# Altium project OSD19001_BRK_X2.PrjPCB
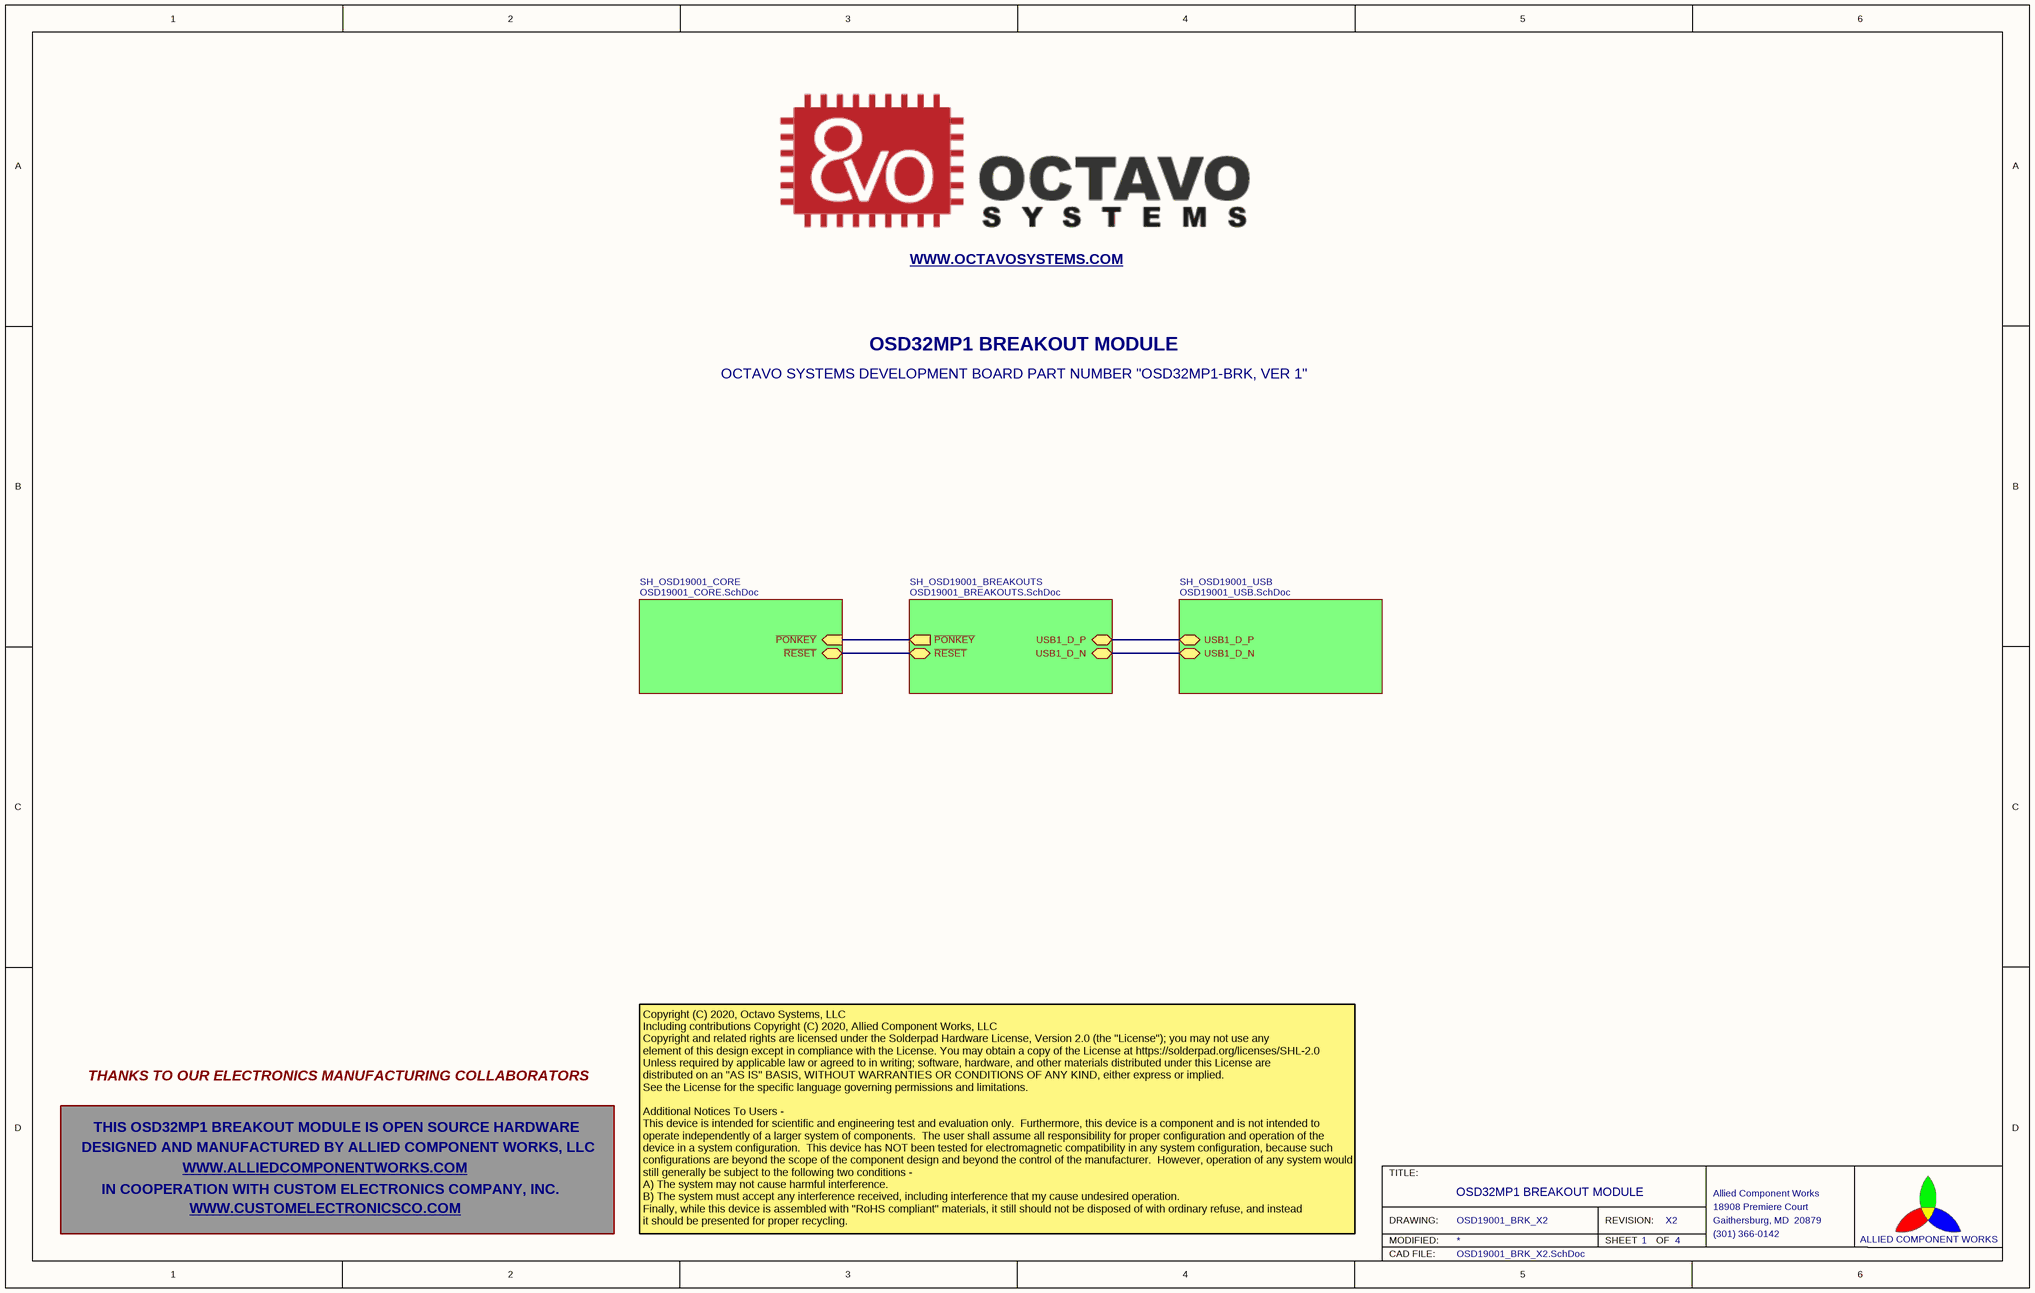
[diagram p0: OSD19001_BRK_X2.SchDoc]
ProjectAddress1: 18908 Premiere Court; ProjectAddress2: Gaithersburg, MD  20879; ProjectCompanyDrawingNumber: OSD19001_BRK_X2; ProjectCompanyName: Allied Component Works; ProjectCompanyPhone: (301) 366-0142; ProjectDrawingNUmber: OSD19001_BRK_X2; ProjectRevision: X2
4 sheets, 162 parts. Net scope: hierarchical (ports join the sheet entries above them; power ports are global).
Board file: OSD19001_BRK_X2.PcbDoc
Sheets:
  OSD19001_BRK_X2.SchDoc
    SH_OSD19001_CORE = OSD19001_CORE.SchDoc
    SH_OSD19001_BREAKOUTS = OSD19001_BREAKOUTS.SchDoc
    SH_OSD19001_USB = OSD19001_USB.SchDoc

## Sheet OSD19001_BRK_X2.SchDoc
size B; Organization: Altium Limited; DocumentNumber: 1; SheetNumber: 1; SheetTotal: 4; SchematicTitle: OSD32MP1 BREAKOUT MODULE

### Sub-sheets
SH_OSD19001_BREAKOUTS = OSD19001_BREAKOUTS.SchDoc: ~{PONKEY} (out), ~{RESET} (bidir), USB1_D_P (bidir), USB1_D_N (bidir)
SH_OSD19001_CORE = OSD19001_CORE.SchDoc: ~{PONKEY} (in), ~{RESET} (bidir)
SH_OSD19001_USB = OSD19001_USB.SchDoc: USB1_D_P (bidir), USB1_D_N (bidir)

### Nets
~{PONKEY}: sheet SH_OSD19001_CORE/~{PONKEY}, sheet SH_OSD19001_BREAKOUTS/~{PONKEY}
~{RESET}: sheet SH_OSD19001_CORE/~{RESET}, sheet SH_OSD19001_BREAKOUTS/~{RESET}
USB1_D_N: sheet SH_OSD19001_BREAKOUTS/USB1_D_N, sheet SH_OSD19001_USB/USB1_D_N
USB1_D_P: sheet SH_OSD19001_BREAKOUTS/USB1_D_P, sheet SH_OSD19001_USB/USB1_D_P

### Notes on the sheet
- WWW.OCTAVOSYSTEMS.COM <http://WWW.OCTAVOSYSTEMS.COM>
- OSD32MP1 BREAKOUT MODULE
- OCTAVO SYSTEMS DEVELOPMENT BOARD PART NUMBER "OSD32MP1-BRK, VER 1"
- THANKS TO OUR ELECTRONICS MANUFACTURING COLLABORATORS
- DESIGNED AND MANUFACTURED BY ALLIED COMPONENT WORKS, LLC
- THIS OSD32MP1 BREAKOUT MODULE IS OPEN SOURCE HARDWARE
- WWW.ALLIEDCOMPONENTWORKS.COM <http://WWW.ALLIEDCOMPONENTWORKS.COM>
- IN COOPERATION WITH CUSTOM ELECTRONICS COMPANY, INC.
- WWW.CUSTOMELECTRONICSCO.COM <http://WWW.CUSTOMELECTRONICSCO.COM>
- Copyright (C) 2020, Octavo Systems, LLC
  Including contributions Copyright (C) 2020, Allied Component Works, LLC
  Copyright and related rights are licensed under the Solderpad Hardware License, Version 2.0 (the "License"); you may not use any
  element of this design except in compliance with the License. You may obtain a copy of the License at https://solderpad.org/licenses/SHL-2.0
  Unless required by applicable law or agreed to in writing; software, hardware, and other materials distributed under this License are
  distributed on an "AS IS" BASIS, WITHOUT WARRANTIES OR CONDITIONS OF ANY KIND, either express or implied.
  See the License for the specific language governing permissions and limitations.
  Additional Notices To Users -
  This device is intended for scientific and engineering test and evaluation only.  Furthermore, this device is a component and is not intended to operate independently of a larger system of components.  The user shall assume all responsibility for proper configuration and operation of the device in a system configuration.  This device has NOT been tested for electromagnetic compatibility in any system configuration, because such configurations are beyond the scope of the component design and beyond the control of the manufacturer.  However, operation of any system would still generally be subject to the following two conditions -
  A) The system may not cause harmful interference.
  B) The system must accept any interference received, including interference that my cause undesired operation.
  Finally, while this device is assembled with "RoHS compliant" materials, it still should not be disposed of with ordinary refuse, and instead
  it should be presented for proper recycling.
- TITLE:
- DRAWING:
- MODIFIED:
- REVISION:
- SHEET
- OF
- ALLIED COMPONENT WORKS
- CAD FILE:

## Sheet OSD19001_CORE.SchDoc: <title>
size B; Organization: Altium Limited; DocumentNumber: 2; SheetNumber: 2; SheetTotal: 4; DrawingNumber: <drawing number>; SchematicTitle: OSD32MP1 BREAKOUT MODULE (CORE)
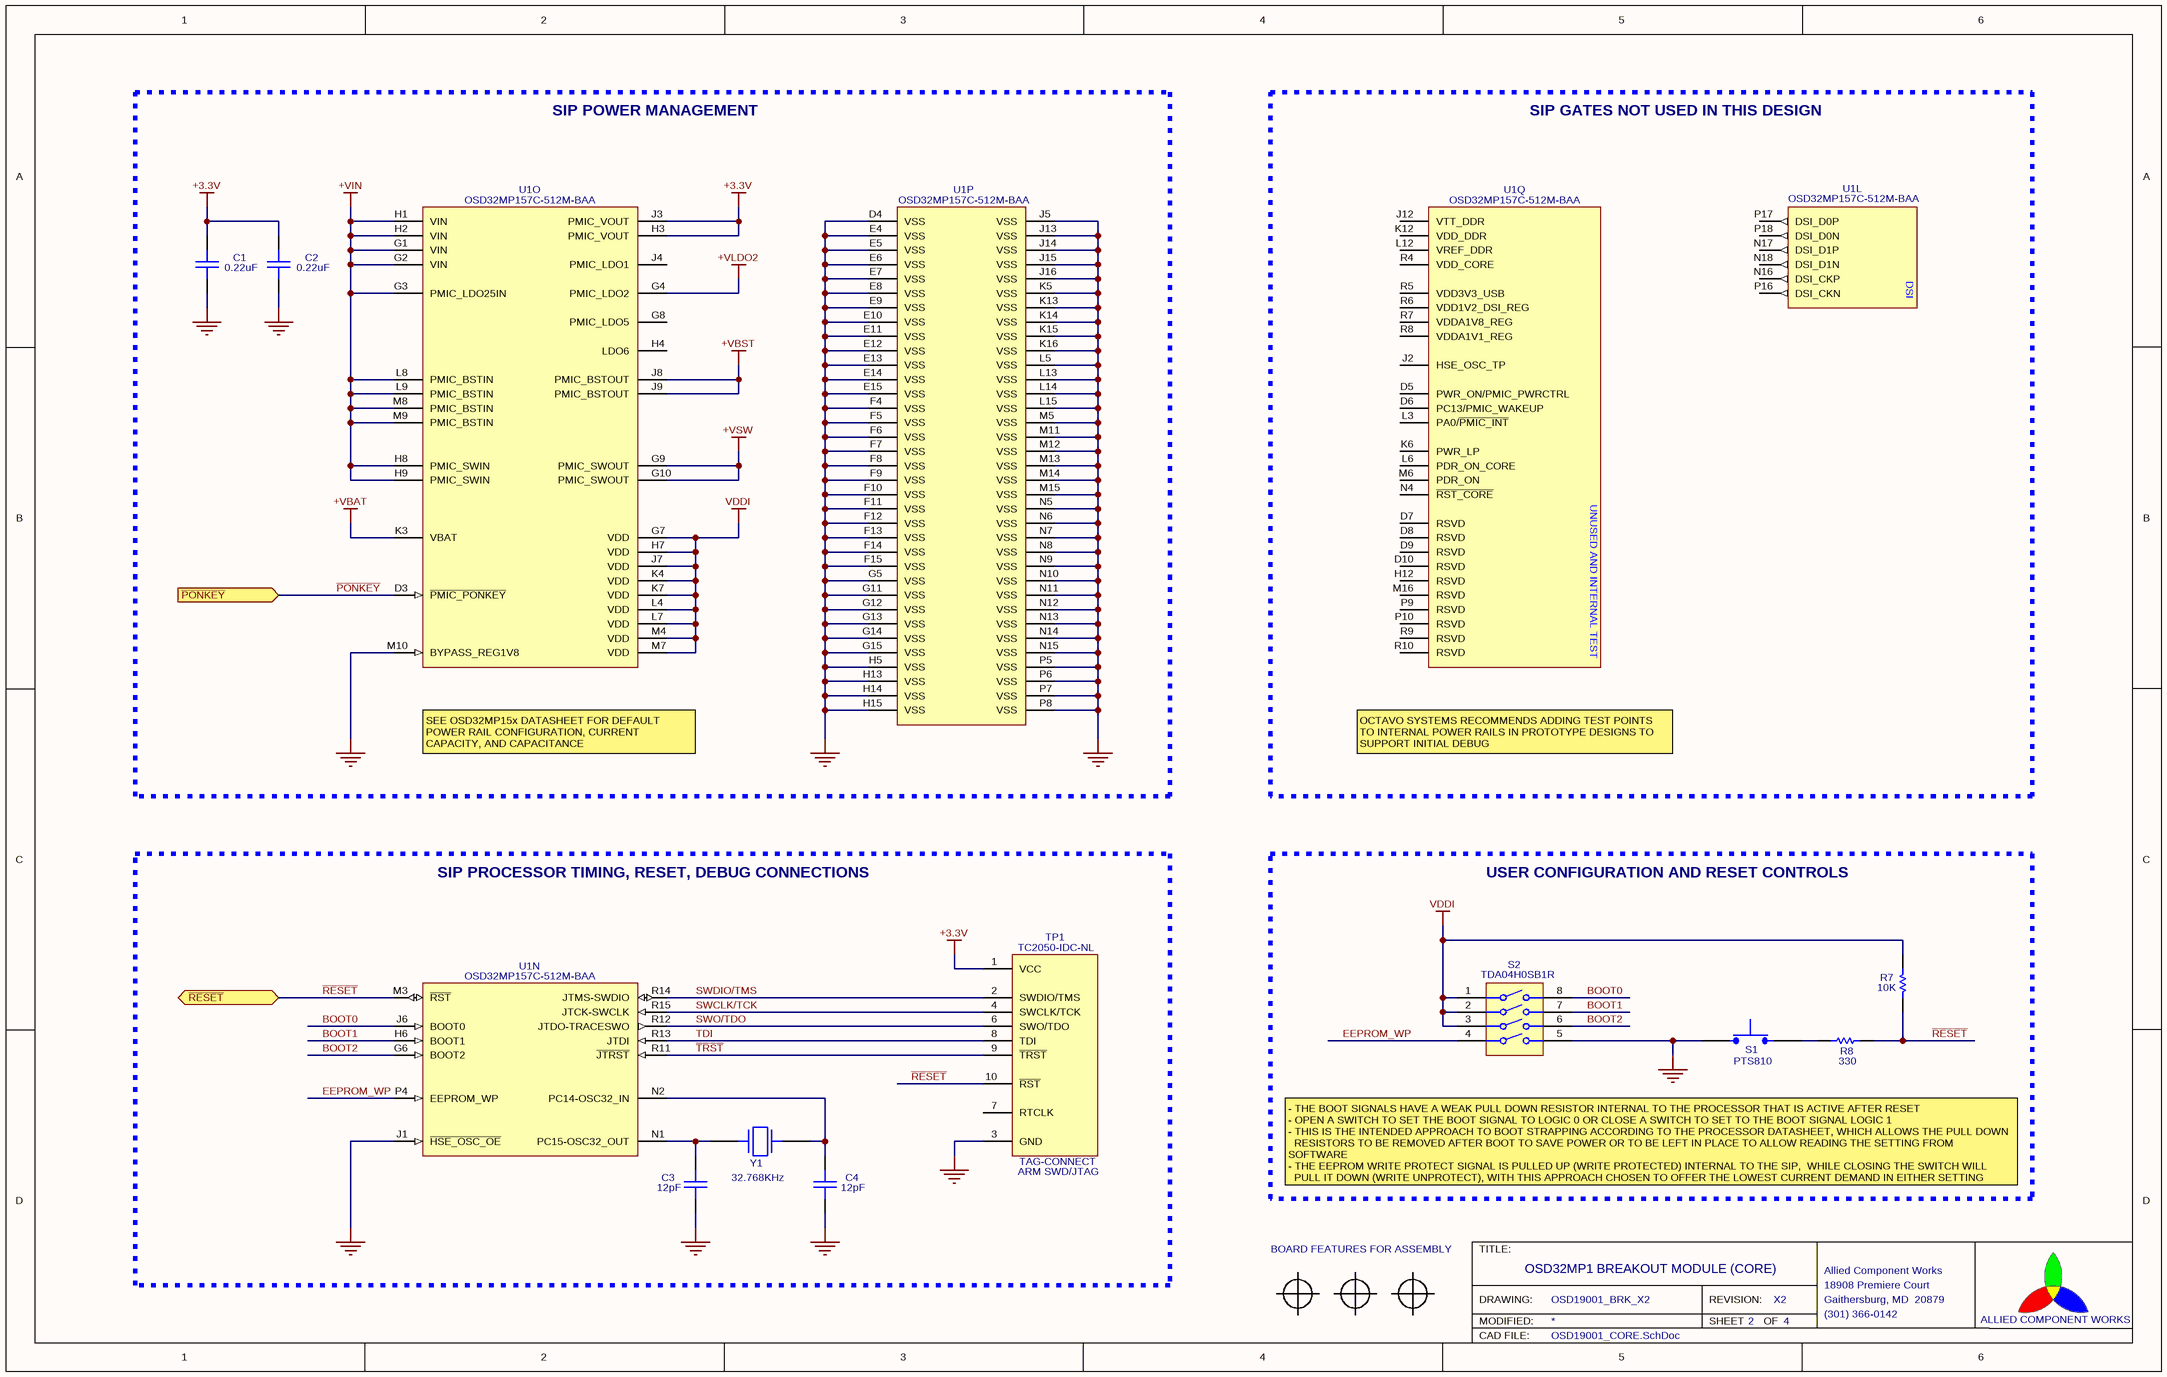
[diagram p1: OSD19001_CORE.SchDoc]

### Parts
C1  0.22uF  [LP_0603_HIGH]
C2  0.22uF  [LP_0603_HIGH]
C3  12pF  [LP_0402_HIGH]
C4  12pF  [LP_0402_HIGH]
FID1  FID  [FID_ROUND_40_TOP]  (value not drawn)
FID2  FID  [FID_ROUND_40_TOP]  (value not drawn)
FID3  FID  [FID_ROUND_40_TOP]  (value not drawn)
R7  10K  [LP_0402_LOW]
R8  330  [LP_0402_LOW]
S1  PTS810  [C&K_PTS810]
S2  TDA04H0SB1R  [C&K_TDA04]
TP1  TC2050-IDC-NL  [TC2050_SITE_NL]
U1  OSD32MP157C-512M-BAA  [BGA_OCTAVO_SIP_OSD32MP157C]  (parts L,N,O,P,Q of 17)
Y1  32.768KHz  [NDK_CRYSTAL_1.5X3.2]

### Blocks framed on the sheet
SIP POWER MANAGEMENT: C1 C2 U1
SIP GATES NOT USED IN THIS DESIGN: U1
SIP PROCESSOR TIMING, RESET, DEBUG CONNECTIONS: C3 C4 TP1 U1 Y1
USER CONFIGURATION AND RESET CONTROLS: R7 R8 S1 S2

### Ports
~{PONKEY} (in), ~{RESET} (bidir)

### Nets
+3.3V: C1.1 C2.1 TP1.1(VCC) U1.H3(PMIC_VOUT) U1.J3(PMIC_VOUT)
+VBAT: U1.K3(VBAT)
+VBST: U1.J8(PMIC_BSTOUT) U1.J9(PMIC_BSTOUT)
+VIN: U1.G1(VIN) U1.G2(VIN) U1.G3(PMIC_LDO25IN) U1.H1(VIN) U1.H2(VIN) U1.H8(PMIC_SWIN) U1.H9(PMIC_SWIN) U1.L8(PMIC_BSTIN) U1.L9(PMIC_BSTIN) U1.M8(PMIC_BSTIN) U1.M9(PMIC_BSTIN)
+VLDO2: U1.G4(PMIC_LDO2)
+VSW: U1.G9(PMIC_SWOUT) U1.G10(PMIC_SWOUT)
GND: C1.2 C2.2 C3.2 C4.2 S1.2 S2.5 TP1.3(GND) U1.D4(VSS) U1.E4(VSS) U1.E5(VSS) U1.E6(VSS) U1.E7(VSS) U1.E8(VSS) U1.E9(VSS) U1.E10(VSS) U1.E11(VSS) U1.E12(VSS) U1.E13(VSS) U1.E14(VSS) U1.E15(VSS) U1.F4(VSS) U1.F5(VSS) U1.F6(VSS) U1.F7(VSS) U1.F8(VSS) U1.F9(VSS) U1.F10(VSS) U1.F11(VSS) U1.F12(VSS) U1.F13(VSS) U1.F14(VSS) U1.F15(VSS) U1.G5(VSS) U1.G11(VSS) U1.G12(VSS) U1.G13(VSS) U1.G14(VSS) U1.G15(VSS) U1.H5(VSS) U1.H13(VSS) U1.H14(VSS) U1.H15(VSS) U1.J1(~{HSE_OSC_OE}) U1.J5(VSS) U1.J13(VSS) U1.J14(VSS) U1.J15(VSS) U1.J16(VSS) U1.K5(VSS) U1.K13(VSS) U1.K14(VSS) U1.K15(VSS) U1.K16(VSS) U1.L5(VSS) U1.L13(VSS) U1.L14(VSS) U1.L15(VSS) U1.M5(VSS) U1.M10(BYPASS_REG1V8) U1.M11(VSS) U1.M12(VSS) U1.M13(VSS) U1.M14(VSS) U1.M15(VSS) U1.N5(VSS) U1.N6(VSS) U1.N7(VSS) U1.N8(VSS) U1.N9(VSS) U1.N10(VSS) U1.N11(VSS) U1.N12(VSS) U1.N13(VSS) U1.N14(VSS) U1.N15(VSS) U1.P5(VSS) U1.P6(VSS) U1.P7(VSS) U1.P8(VSS)
VDDI: R7.2 S2.1 S2.2 S2.3 U1.G7(VDD) U1.H7(VDD) U1.J7(VDD) U1.K4(VDD) U1.K7(VDD) U1.L4(VDD) U1.L7(VDD) U1.M4(VDD) U1.M7(VDD)
~{PONKEY}: U1.D3(~{PMIC_PONKEY}) ; port ~{PONKEY}
~{RESET}: R7.1 R8.2 TP1.10(~{RST}) U1.M3(~{RST}) ; port ~{RESET}
~{TRST}: TP1.9(~{TRST}) U1.R11(~{JTRST})
BOOT0: S2.8 U1.J6(BOOT0)
BOOT1: S2.7 U1.H6(BOOT1)
BOOT2: S2.6 U1.G6(BOOT2)
EEPROM_WP: S2.4 U1.P4(EEPROM_WP)
SWCLK/TCK: TP1.4(SWCLK/TCK) U1.R15(JTCK-SWCLK)
SWDIO/TMS: TP1.2(SWDIO/TMS) U1.R14(JTMS-SWDIO)
SWO/TDO: TP1.6(SWO/TDO) U1.R12(JTDO-TRACESWO)
TDI: TP1.8(TDI) U1.R13(JTDI)
NetC3_1: C3.1 U1.N1(PC15-OSC32_OUT) Y1.2
NetC4_1: C4.1 U1.N2(PC14-OSC32_IN) Y1.1
NetR8_1: R8.1 S1.1

Not connected (* = marked no-connect by the designer): TP1 7(RTCLK); U1 D5(PWR_ON/PMIC_PWRCTRL) D6(PC13/PMIC_WAKEUP) D7(RSVD) D8(RSVD) D9(RSVD) D10(RSVD) G8(PMIC_LDO5) H4(LDO6) H12(RSVD) J2(HSE_OSC_TP) J4(PMIC_LDO1) J12(VTT_DDR) K6(PWR_LP) K12(VDD_DDR) L3(PA0/~{PMIC_INT}) L6(PDR_ON_CORE) L12(VREF_DDR) M6(PDR_ON) M16(RSVD) N4(~{RST_CORE}) N16(DSI_CKP) N17(DSI_D1P) N18(DSI_D1N) P9(RSVD) P10(RSVD) P16(DSI_CKN) P17(DSI_D0P) P18(DSI_D0N) R4(VDD_CORE) R5(VDD3V3_USB) R6(VDD1V2_DSI_REG) R7(VDDA1V8_REG) R8(VDDA1V1_REG) R9(RSVD) R10(RSVD)

### Notes on the sheet
- SEE OSD32MP15x DATASHEET FOR DEFAULT POWER RAIL CONFIGURATION, CURRENT CAPACITY, AND CAPACITANCE RECOMMENDATIONS
- OCTAVO SYSTEMS RECOMMENDS ADDING TEST POINTS
  TO INTERNAL POWER RAILS IN PROTOTYPE DESIGNS TO SUPPORT INITIAL DEBUG
- - THE BOOT SIGNALS HAVE A WEAK PULL DOWN RESISTOR INTERNAL TO THE PROCESSOR THAT IS ACTIVE AFTER RESET
  - OPEN A SWITCH TO SET THE BOOT SIGNAL TO LOGIC 0 OR CLOSE A SWITCH TO SET TO THE BOOT SIGNAL LOGIC 1
  - THIS IS THE INTENDED APPROACH TO BOOT STRAPPING ACCORDING TO THE PROCESSOR DATASHEET, WHICH ALLOWS THE PULL DOWN
  RESISTORS TO BE REMOVED AFTER BOOT TO SAVE POWER OR TO BE LEFT IN PLACE TO ALLOW READING THE SETTING FROM SOFTWARE
  - THE EEPROM WRITE PROTECT SIGNAL IS PULLED UP (WRITE PROTECTED) INTERNAL TO THE SIP,  WHILE CLOSING THE SWITCH WILL
  PULL IT DOWN (WRITE UNPROTECT), WITH THIS APPROACH CHOSEN TO OFFER THE LOWEST CURRENT DEMAND IN EITHER SETTING
- BOARD FEATURES FOR ASSEMBLY
- TITLE:
- DRAWING:
- MODIFIED:
- REVISION:
- SHEET
- OF
- ALLIED COMPONENT WORKS
- CAD FILE:
- (in symbol OSD32MP157C, part L) DSI
- (in symbol OSD32MP157C, part Q) UNUSED AND INTERNAL TEST
- (in symbol TC2050) TAG-CONNECT; ARM SWD/JTAG

### Library data of the parts
C1-C4 = CERCAP: Tolerance: 10%; Voltage: 25V
  C1 C2: Value: 0.22uF
  C3 C4: PartNumber: *; Value: 12pF
FID1-FID3 = FIDUCIAL
R7 R8 = RESISTOR: Tolerance: 5%; Power: 0.1W; Voltage: 50V
  R7: Value: 10K
  R8: Value: 330
S1 = TACT_SWITCH: SPST Tactile Switch, 2 Active Pins; PartNumber: PTS810
S2 = DIP_SW_4: Four Position DIP Switch; PartNumber: TDA04H0SB1R
TP1 = TC2050: Tag Connect Site, 10-Pin; PartNumber: TC2050-IDC-NL
U1 = OSD32MP157C: Octavo ST Processor SIP; Manufacturer: Octavo Systems; PartNumber: OSD32MP157C-512M-BAA; ComponentLink1Description: TBD; ComponentLink1URL: http://TBD
Y1 = CRYSTAL_2PIN: Crystal; PartNumber: NX3215SA-32.768K-STD-MUA-9; Frequency: 32.768KHz

## Sheet OSD19001_BREAKOUTS.SchDoc: <title>
size B; CompanyName: Allied Component Works; Organization: Altium Limited; DocumentNumber: 3; Revision: X1; SheetNumber: 3; SheetTotal: 4; DrawingNumber: <drawing number>; SchematicTitle: OSD32MP1 BREAKOUT MODULE (BREAKOUTS)
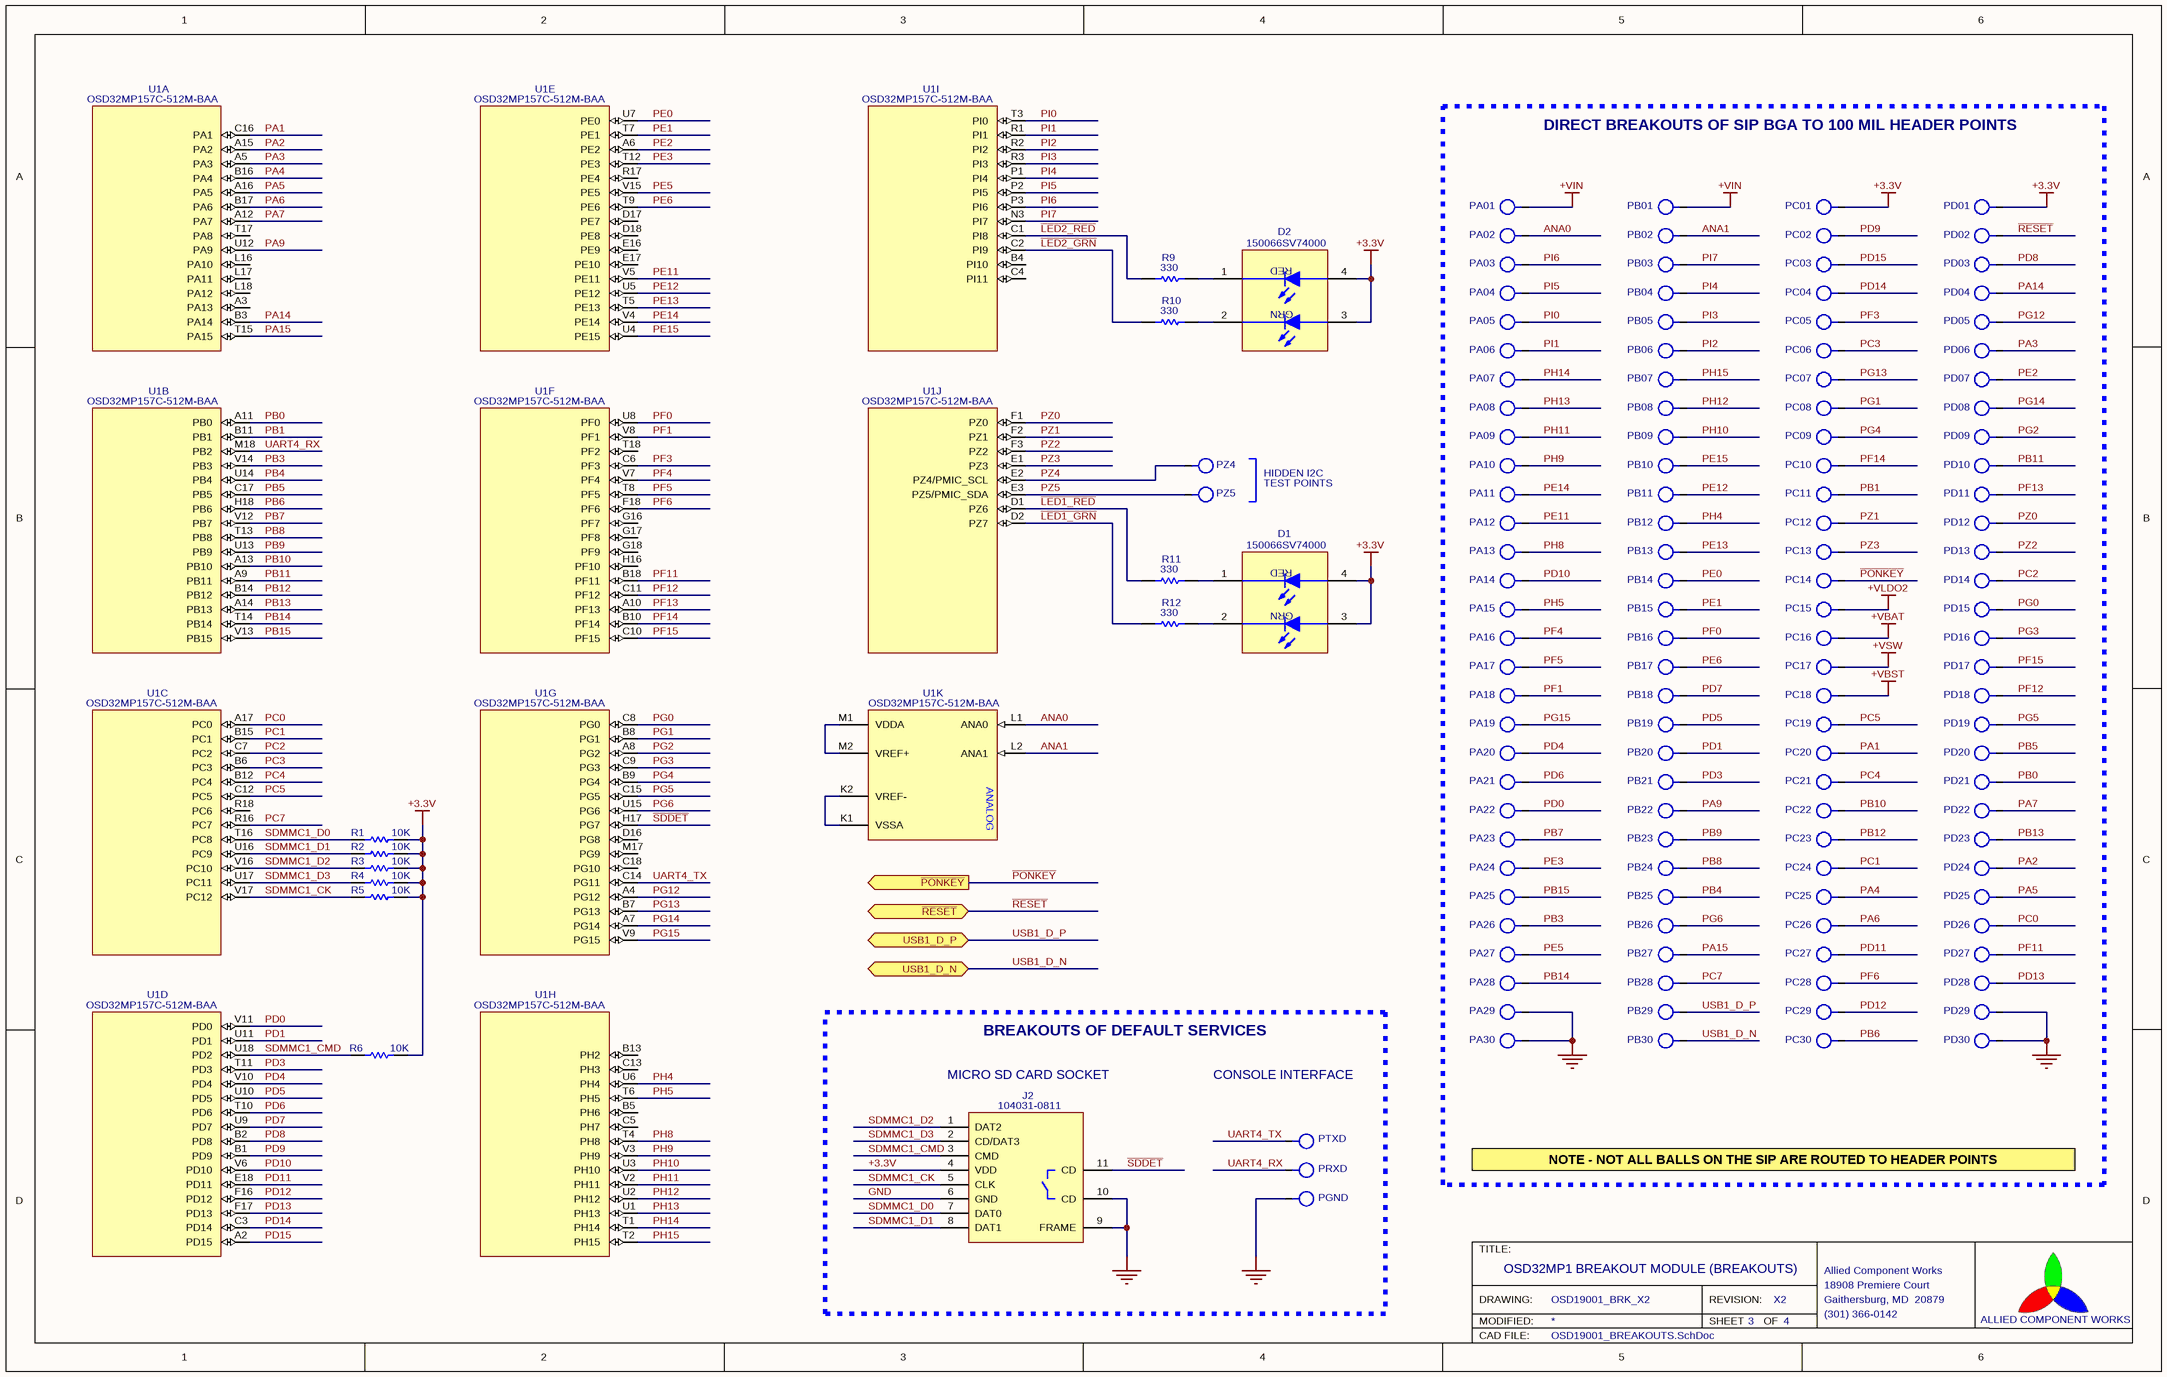
[diagram p2: OSD19001_BREAKOUTS.SchDoc]

### Parts
D1  150066SV74000  [WURTH_DUAL_0606]
D2  150066SV74000  [WURTH_DUAL_0606]
J2  104031-0811  [MOLEX_104031-0811]
PA01  TP  [LP_TESTPOINT_TH]  (value not drawn)
PA02  TP  [LP_TESTPOINT_TH]  (value not drawn)
PA03  TP  [LP_TESTPOINT_TH]  (value not drawn)
PA04  TP  [LP_TESTPOINT_TH]  (value not drawn)
PA05  TP  [LP_TESTPOINT_TH]  (value not drawn)
PA06  TP  [LP_TESTPOINT_TH]  (value not drawn)
PA07  TP  [LP_TESTPOINT_TH]  (value not drawn)
PA08  TP  [LP_TESTPOINT_TH]  (value not drawn)
PA09  TP  [LP_TESTPOINT_TH]  (value not drawn)
PA10  TP  [LP_TESTPOINT_TH]  (value not drawn)
PA11  TP  [LP_TESTPOINT_TH]  (value not drawn)
PA12  TP  [LP_TESTPOINT_TH]  (value not drawn)
PA13  TP  [LP_TESTPOINT_TH]  (value not drawn)
PA14  TP  [LP_TESTPOINT_TH]  (value not drawn)
PA15  TP  [LP_TESTPOINT_TH]  (value not drawn)
PA16  TP  [LP_TESTPOINT_TH]  (value not drawn)
PA17  TP  [LP_TESTPOINT_TH]  (value not drawn)
PA18  TP  [LP_TESTPOINT_TH]  (value not drawn)
PA19  TP  [LP_TESTPOINT_TH]  (value not drawn)
PA20  TP  [LP_TESTPOINT_TH]  (value not drawn)
PA21  TP  [LP_TESTPOINT_TH]  (value not drawn)
PA22  TP  [LP_TESTPOINT_TH]  (value not drawn)
PA23  TP  [LP_TESTPOINT_TH]  (value not drawn)
PA24  TP  [LP_TESTPOINT_TH]  (value not drawn)
PA25  TP  [LP_TESTPOINT_TH]  (value not drawn)
PA26  TP  [LP_TESTPOINT_TH]  (value not drawn)
PA27  TP  [LP_TESTPOINT_TH]  (value not drawn)
PA28  TP  [LP_TESTPOINT_TH]  (value not drawn)
PA29  TP  [LP_TESTPOINT_TH]  (value not drawn)
PA30  TP  [LP_TESTPOINT_TH]  (value not drawn)
PB01  TP  [LP_TESTPOINT_TH]  (value not drawn)
PB02  TP  [LP_TESTPOINT_TH]  (value not drawn)
PB03  TP  [LP_TESTPOINT_TH]  (value not drawn)
PB04  TP  [LP_TESTPOINT_TH]  (value not drawn)
PB05  TP  [LP_TESTPOINT_TH]  (value not drawn)
PB06  TP  [LP_TESTPOINT_TH]  (value not drawn)
PB07  TP  [LP_TESTPOINT_TH]  (value not drawn)
PB08  TP  [LP_TESTPOINT_TH]  (value not drawn)
PB09  TP  [LP_TESTPOINT_TH]  (value not drawn)
PB10  TP  [LP_TESTPOINT_TH]  (value not drawn)
PB11  TP  [LP_TESTPOINT_TH]  (value not drawn)
PB12  TP  [LP_TESTPOINT_TH]  (value not drawn)
PB13  TP  [LP_TESTPOINT_TH]  (value not drawn)
PB14  TP  [LP_TESTPOINT_TH]  (value not drawn)
PB15  TP  [LP_TESTPOINT_TH]  (value not drawn)
PB16  TP  [LP_TESTPOINT_TH]  (value not drawn)
PB17  TP  [LP_TESTPOINT_TH]  (value not drawn)
PB18  TP  [LP_TESTPOINT_TH]  (value not drawn)
PB19  TP  [LP_TESTPOINT_TH]  (value not drawn)
PB20  TP  [LP_TESTPOINT_TH]  (value not drawn)
PB21  TP  [LP_TESTPOINT_TH]  (value not drawn)
PB22  TP  [LP_TESTPOINT_TH]  (value not drawn)
PB23  TP  [LP_TESTPOINT_TH]  (value not drawn)
PB24  TP  [LP_TESTPOINT_TH]  (value not drawn)
PB25  TP  [LP_TESTPOINT_TH]  (value not drawn)
PB26  TP  [LP_TESTPOINT_TH]  (value not drawn)
PB27  TP  [LP_TESTPOINT_TH]  (value not drawn)
PB28  TP  [LP_TESTPOINT_TH]  (value not drawn)
PB29  TP  [LP_TESTPOINT_TH]  (value not drawn)
PB30  TP  [LP_TESTPOINT_TH]  (value not drawn)
PC01  TP  [LP_TESTPOINT_TH]  (value not drawn)
PC02  TP  [LP_TESTPOINT_TH]  (value not drawn)
PC03  TP  [LP_TESTPOINT_TH]  (value not drawn)
PC04  TP  [LP_TESTPOINT_TH]  (value not drawn)
PC05  TP  [LP_TESTPOINT_TH]  (value not drawn)
PC06  TP  [LP_TESTPOINT_TH]  (value not drawn)
PC07  TP  [LP_TESTPOINT_TH]  (value not drawn)
PC08  TP  [LP_TESTPOINT_TH]  (value not drawn)
PC09  TP  [LP_TESTPOINT_TH]  (value not drawn)
PC10  TP  [LP_TESTPOINT_TH]  (value not drawn)
PC11  TP  [LP_TESTPOINT_TH]  (value not drawn)
PC12  TP  [LP_TESTPOINT_TH]  (value not drawn)
PC13  TP  [LP_TESTPOINT_TH]  (value not drawn)
PC14  TP  [LP_TESTPOINT_TH]  (value not drawn)
PC15  TP  [LP_TESTPOINT_TH]  (value not drawn)
PC16  TP  [LP_TESTPOINT_TH]  (value not drawn)
PC17  TP  [LP_TESTPOINT_TH]  (value not drawn)
PC18  TP  [LP_TESTPOINT_TH]  (value not drawn)
PC19  TP  [LP_TESTPOINT_TH]  (value not drawn)
PC20  TP  [LP_TESTPOINT_TH]  (value not drawn)
PC21  TP  [LP_TESTPOINT_TH]  (value not drawn)
PC22  TP  [LP_TESTPOINT_TH]  (value not drawn)
PC23  TP  [LP_TESTPOINT_TH]  (value not drawn)
PC24  TP  [LP_TESTPOINT_TH]  (value not drawn)
PC25  TP  [LP_TESTPOINT_TH]  (value not drawn)
PC26  TP  [LP_TESTPOINT_TH]  (value not drawn)
PC27  TP  [LP_TESTPOINT_TH]  (value not drawn)
PC28  TP  [LP_TESTPOINT_TH]  (value not drawn)
PC29  TP  [LP_TESTPOINT_TH]  (value not drawn)
PC30  TP  [LP_TESTPOINT_TH]  (value not drawn)
PD01  TP  [LP_TESTPOINT_TH]  (value not drawn)
PD02  TP  [LP_TESTPOINT_TH]  (value not drawn)
PD03  TP  [LP_TESTPOINT_TH]  (value not drawn)
PD04  TP  [LP_TESTPOINT_TH]  (value not drawn)
PD05  TP  [LP_TESTPOINT_TH]  (value not drawn)
PD06  TP  [LP_TESTPOINT_TH]  (value not drawn)
PD07  TP  [LP_TESTPOINT_TH]  (value not drawn)
PD08  TP  [LP_TESTPOINT_TH]  (value not drawn)
PD09  TP  [LP_TESTPOINT_TH]  (value not drawn)
PD10  TP  [LP_TESTPOINT_TH]  (value not drawn)
PD11  TP  [LP_TESTPOINT_TH]  (value not drawn)
PD12  TP  [LP_TESTPOINT_TH]  (value not drawn)
PD13  TP  [LP_TESTPOINT_TH]  (value not drawn)
PD14  TP  [LP_TESTPOINT_TH]  (value not drawn)
PD15  TP  [LP_TESTPOINT_TH]  (value not drawn)
PD16  TP  [LP_TESTPOINT_TH]  (value not drawn)
PD17  TP  [LP_TESTPOINT_TH]  (value not drawn)
PD18  TP  [LP_TESTPOINT_TH]  (value not drawn)
PD19  TP  [LP_TESTPOINT_TH]  (value not drawn)
PD20  TP  [LP_TESTPOINT_TH]  (value not drawn)
PD21  TP  [LP_TESTPOINT_TH]  (value not drawn)
PD22  TP  [LP_TESTPOINT_TH]  (value not drawn)
PD23  TP  [LP_TESTPOINT_TH]  (value not drawn)
PD24  TP  [LP_TESTPOINT_TH]  (value not drawn)
PD25  TP  [LP_TESTPOINT_TH]  (value not drawn)
PD26  TP  [LP_TESTPOINT_TH]  (value not drawn)
PD27  TP  [LP_TESTPOINT_TH]  (value not drawn)
PD28  TP  [LP_TESTPOINT_TH]  (value not drawn)
PD29  TP  [LP_TESTPOINT_TH]  (value not drawn)
PD30  TP  [LP_TESTPOINT_TH]  (value not drawn)
PGND  TP  [LP_TESTPOINT_TH]  (value not drawn)
PRXD  TP  [LP_TESTPOINT_TH]  (value not drawn)
PTXD  TP  [LP_TESTPOINT_TH]  (value not drawn)
PZ4  TP  [LP_TESTPOINT_SMT]  (value not drawn)
PZ5  TP  [LP_TESTPOINT_SMT]  (value not drawn)
R1  10K  [LP_0402_LOW]
R2  10K  [LP_0402_LOW]
R3  10K  [LP_0402_LOW]
R4  10K  [LP_0402_LOW]
R5  10K  [LP_0402_LOW]
R6  10K  [LP_0402_LOW]
R9  330  [LP_0402_LOW]
R10  330  [LP_0402_LOW]
R11  330  [LP_0402_LOW]
R12  330  [LP_0402_LOW]
U1  OSD32MP157C-512M-BAA  [BGA_OCTAVO_SIP_OSD32MP157C]  (parts A,B,C,D,E,F,G,H,I,J,K of 17)

### Blocks framed on the sheet
DIRECT BREAKOUTS OF SIP BGA TO 100 MIL HEADER POINTS: PA01 PA02 PA03 PA04 PA05 PA06 PA07 PA08 PA09-PA30 PB01 PB02 PB03 PB04 PB05 PB06 PB07 PB08 PB09-PB30 PC01 PC02 PC03 PC04 PC05 PC06 PC07 PC08 PC09-PC30 PD01 PD02 PD03 PD04 PD05 PD06 PD07 PD08 PD09-PD30
BREAKOUTS OF DEFAULT SERVICES: J2 PGND PRXD PTXD

### Ports
USB1_D_N (bidir), USB1_D_P (bidir), ~{PONKEY} (out), ~{RESET} (bidir)

### Nets
+3.3V: D1.3(A) D1.4(A) D2.3(A) D2.4(A) J2.4(VDD) PC01.1 PD01.1 R1.2 R2.2 R3.2 R4.2 R5.2 R6.2
+VBAT: PC16.1
+VBST: PC18.1
+VIN: PA01.1 PB01.1
+VLDO2: PC15.1
+VSW: PC17.1
GND: J2.6(GND) J2.9(FRAME) J2.10(CD) PA29.1 PA30.1 PD29.1 PD30.1 PGND.1
~{LED1_GRN}: R12.1 U1.D2(PZ7)
~{LED1_RED}: R11.1 U1.D1(PZ6)
~{LED2_GRN}: R10.1 U1.C2(PI9)
~{LED2_RED}: R9.1 U1.C1(PI8)
~{PONKEY}: PC14.1 ; port ~{PONKEY}
~{RESET}: PD02.1 ; port ~{RESET}
~{SDDET}: J2.11(CD) U1.H17(PG7)
ANA0: PA02.1 U1.L1(ANA0)
ANA1: PB02.1 U1.L2(ANA1)
PA1: PC20.1 U1.C16(PA1)
PA2: PD24.1 U1.A15(PA2)
PA3: PD06.1 U1.A5(PA3)
PA4: PC25.1 U1.B16(PA4)
PA5: PD25.1 U1.A16(PA5)
PA6: PC26.1 U1.B17(PA6)
PA7: PD22.1 U1.A12(PA7)
PA9: PB22.1 U1.U12(PA9)
PA14: PD04.1 U1.B3(PA14)
PA15: PB27.1 U1.T15(PA15)
PB0: PD21.1 U1.A11(PB0)
PB1: PC11.1 U1.B11(PB1)
PB3: PA26.1 U1.V14(PB3)
PB4: PB25.1 U1.U14(PB4)
PB5: PD20.1 U1.C17(PB5)
PB6: PC30.1 U1.H18(PB6)
PB7: PA23.1 U1.V12(PB7)
PB8: PB24.1 U1.T13(PB8)
PB9: PB23.1 U1.U13(PB9)
PB10: PC22.1 U1.A13(PB10)
PB11: PD10.1 U1.A9(PB11)
PB12: PC23.1 U1.B14(PB12)
PB13: PD23.1 U1.A14(PB13)
PB14: PA28.1 U1.T14(PB14)
PB15: PA25.1 U1.V13(PB15)
PC0: PD26.1 U1.A17(PC0)
PC1: PC24.1 U1.B15(PC1)
PC2: PD14.1 U1.C7(PC2)
PC3: PC06.1 U1.B6(PC3)
PC4: PC21.1 U1.B12(PC4)
PC5: PC19.1 U1.C12(PC5)
PC7: PB28.1 U1.R16(PC7)
PD0: PA22.1 U1.V11(PD0)
PD1: PB20.1 U1.U11(PD1)
PD3: PB21.1 U1.T11(PD3)
PD4: PA20.1 U1.V10(PD4)
PD5: PB19.1 U1.U10(PD5)
PD6: PA21.1 U1.T10(PD6)
PD7: PB18.1 U1.U9(PD7)
PD8: PD03.1 U1.B2(PD8)
PD9: PC02.1 U1.B1(PD9)
PD10: PA14.1 U1.V6(PD10)
PD11: PC27.1 U1.E18(PD11)
PD12: PC29.1 U1.F16(PD12)
PD13: PD28.1 U1.F17(PD13)
PD14: PC04.1 U1.C3(PD14)
PD15: PC03.1 U1.A2(PD15)
PE0: PB14.1 U1.U7(PE0)
PE1: PB15.1 U1.T7(PE1)
PE2: PD07.1 U1.A6(PE2)
PE3: PA24.1 U1.T12(PE3)
PE5: PA27.1 U1.V15(PE5)
PE6: PB17.1 U1.T9(PE6)
PE11: PA12.1 U1.V5(PE11)
PE12: PB11.1 U1.U5(PE12)
PE13: PB13.1 U1.T5(PE13)
PE14: PA11.1 U1.V4(PE14)
PE15: PB10.1 U1.U4(PE15)
PF0: PB16.1 U1.U8(PF0)
PF1: PA18.1 U1.V8(PF1)
PF3: PC05.1 U1.C6(PF3)
PF4: PA16.1 U1.V7(PF4)
PF5: PA17.1 U1.T8(PF5)
PF6: PC28.1 U1.F18(PF6)
PF11: PD27.1 U1.B18(PF11)
PF12: PD18.1 U1.C11(PF12)
PF13: PD11.1 U1.A10(PF13)
PF14: PC10.1 U1.B10(PF14)
PF15: PD17.1 U1.C10(PF15)
PG0: PD15.1 U1.C8(PG0)
PG1: PC08.1 U1.B8(PG1)
PG2: PD09.1 U1.A8(PG2)
PG3: PD16.1 U1.C9(PG3)
PG4: PC09.1 U1.B9(PG4)
PG5: PD19.1 U1.C15(PG5)
PG6: PB26.1 U1.U15(PG6)
PG12: PD05.1 U1.A4(PG12)
PG13: PC07.1 U1.B7(PG13)
PG14: PD08.1 U1.A7(PG14)
PG15: PA19.1 U1.V9(PG15)
PH4: PB12.1 U1.U6(PH4)
PH5: PA15.1 U1.T6(PH5)
PH8: PA13.1 U1.T4(PH8)
PH9: PA10.1 U1.V3(PH9)
PH10: PB09.1 U1.U3(PH10)
PH11: PA09.1 U1.V2(PH11)
PH12: PB08.1 U1.U2(PH12)
PH13: PA08.1 U1.U1(PH13)
PH14: PA07.1 U1.T1(PH14)
PH15: PB07.1 U1.T2(PH15)
PI0: PA05.1 U1.T3(PI0)
PI1: PA06.1 U1.R1(PI1)
PI2: PB06.1 U1.R2(PI2)
PI3: PB05.1 U1.R3(PI3)
PI4: PB04.1 U1.P1(PI4)
PI5: PA04.1 U1.P2(PI5)
PI6: PA03.1 U1.P3(PI6)
PI7: PB03.1 U1.N3(PI7)
PZ0: PD12.1 U1.F1(PZ0)
PZ1: PC12.1 U1.F2(PZ1)
PZ2: PD13.1 U1.F3(PZ2)
PZ3: PC13.1 U1.E1(PZ3)
PZ4: PZ4.1 U1.E2(PZ4/PMIC_SCL)
PZ5: PZ5.1 U1.E3(PZ5/PMIC_SDA)
SDMMC1_CK: J2.5(CLK) R5.1 U1.V17(PC12)
SDMMC1_CMD: J2.3(CMD) R6.1 U1.U18(PD2)
SDMMC1_D0: J2.7(DAT0) R1.1 U1.T16(PC8)
SDMMC1_D1: J2.8(DAT1) R2.1 U1.U16(PC9)
SDMMC1_D2: J2.1(DAT2) R3.1 U1.V16(PC10)
SDMMC1_D3: J2.2(CD/DAT3) R4.1 U1.U17(PC11)
UART4_RX: PRXD.1 U1.M18(PB2)
UART4_TX: PTXD.1 U1.C14(PG11)
USB1_D_N: PB30.1 ; port USB1_D_N
USB1_D_P: PB29.1 ; port USB1_D_P
NetD1_1: D1.1(K) R11.2
NetD1_2: D1.2(K) R12.2
NetD2_1: D2.1(K) R9.2
NetD2_2: D2.2(K) R10.2
NetU1_K1: U1.K1(VSSA) U1.K2(VREF-)
NetU1_M1: U1.M1(VDDA) U1.M2(VREF+)

Not connected (* = marked no-connect by the designer): U1 A3(PA13) B4(PI10) B5(PH6) B13(PH2) C4(PI11) C5(PH7) C13(PH3) C18(PG10) D16(PG8) D17(PE7) D18(PE8) E16(PE9) E17(PE10) G16(PF7) G17(PF8) G18(PF9) H16(PF10) L16(PA10) L17(PA11) L18(PA12) M17(PG9) R17(PE4) R18(PC6) T17(PA8) T18(PF2)

### Notes on the sheet
- HIDDEN I2C
- TEST POINTS
- (near J2) MICRO SD CARD SOCKET
- CONSOLE INTERFACE
- NOTE - NOT ALL BALLS ON THE SIP ARE ROUTED TO HEADER POINTS
- TITLE:
- DRAWING:
- MODIFIED:
- REVISION:
- SHEET
- OF
- ALLIED COMPONENT WORKS
- CAD FILE:
- (in symbol LED_DUAL_0606_WURTH) RED; GRN
- (in symbol OSD32MP157C, part K) ANALOG

### Library data of the parts
D1 D2 = LED_DUAL_0606_WURTH: LED, Dual, 4-Wire, SMT; PartNumber: 150066SV74000
J2 = SD_CARD_SW: Micro SD Connector, With CD Switch; PartNumber: 104031-0811
PA01 PA02 PA03 PA04 PA05 PA06 PA07 PA08 PA09-PA30 PB01 PB02 PB03 PB04 PB05 PB06 PB07 PB08 PB09-PB30 PC01 PC02 PC03 PC04 PC05 PC06 PC07 PC08 PC09-PC30 PD01 PD02 PD03 PD04 PD05 PD06 PD07 PD08 PD09-PD30 PGND PRXD PTXD PZ4 PZ5 = TEST_POINT
R1-R6 R9-R12 = RESISTOR: Tolerance: 5%; Power: 0.1W; Voltage: 50V
  R1-R6: Value: 10K
  R9-R12: Value: 330
U1 = OSD32MP157C: as U1 on sheet OSD19001_CORE; PartNumber: OSD32MP157C-512M-BAA; ComponentLink1Description: TBD; ComponentLink1URL: http://TBD

## Sheet OSD19001_USB.SchDoc
size B; Organization: Altium Limited; DocumentNumber: 4; SheetNumber: 4; SheetTotal: 4; SchematicTitle: OSD32MP1 BREAKOUT MODULE (USB)
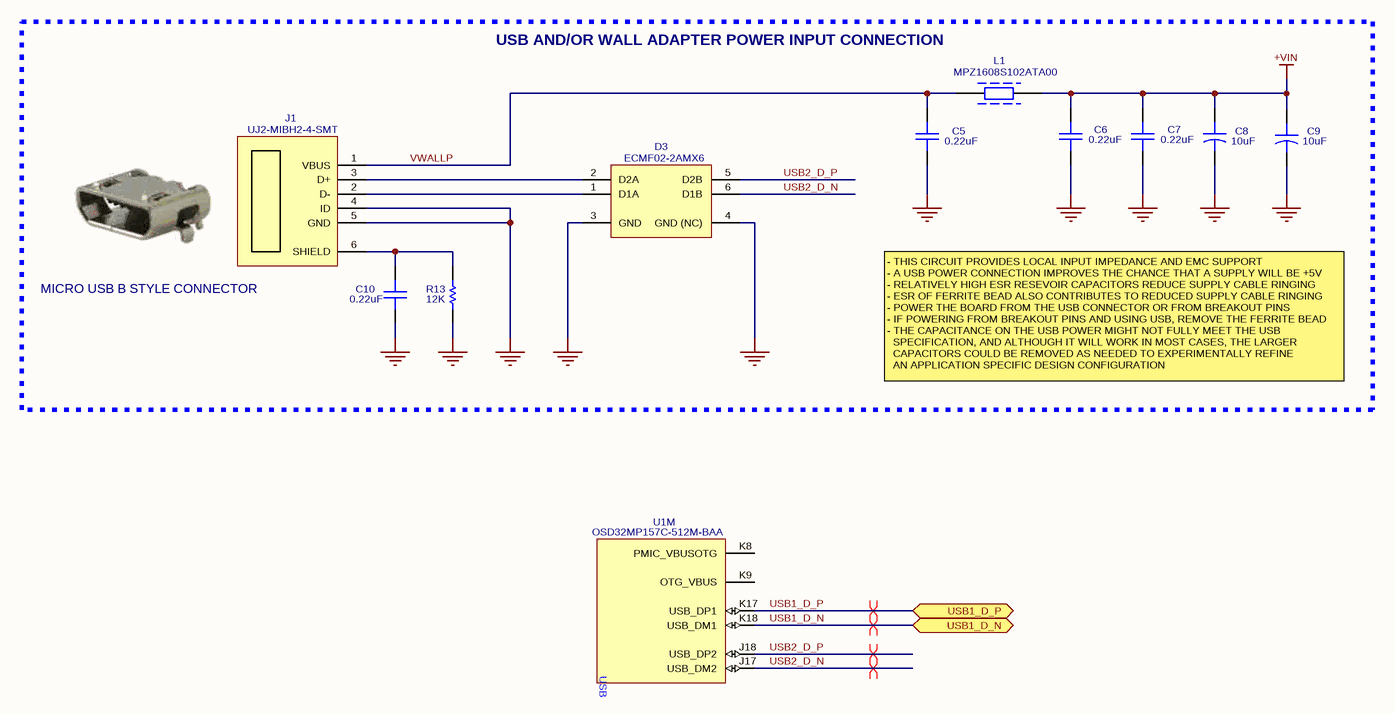
[diagram p3: OSD19001_USB.SchDoc]

### Parts
C5  0.22uF  [LP_0603_HIGH]
C6  0.22uF  [LP_0603_HIGH]
C7  0.22uF  [LP_0603_HIGH]
C8  10uF  [LP_EIAB]
C9  10uF  [LP_EIAB]
C10  0.22uF  [LP_0603_HIGH]
D3  ECMF02-2AMX6  [DFN6_6L_ST]
J1  UJ2-MIBH2-4-SMT  [CUI_UJ2-MIBH2-4-SMT]
L1  MPZ1608S102ATA00  [LP_0603_IND]
R13  12K  [LP_0603_LOW]
U1  OSD32MP157C-512M-BAA  [BGA_OCTAVO_SIP_OSD32MP157C]  (part M of 17)

### Blocks framed on the sheet
USB AND/OR WALL ADAPTER POWER INPUT CONNECTION: C5-C10 D3 J1 L1 R13

### Ports
USB1_D_N (bidir), USB1_D_P (bidir)

### Nets
+VIN: C6.2 C7.2 C8.1 C9.1 L1.2
GND: C5.1 C6.1 C7.1 C8.2 C9.2 C10.1 D3.3(GND) D3.4(GND_(NC)) J1.4(ID) J1.5(GND) R13.1
USB1_D_N: U1.K18(USB_DM1) ; port USB1_D_N
USB1_D_P: U1.K17(USB_DP1) ; port USB1_D_P
USB2_D_N: D3.6(D1B) U1.J17(USB_DM2)
USB2_D_P: D3.5(D2B) U1.J18(USB_DP2)
VWALLP: C5.2 J1.1(VBUS) L1.1
NetC10_2: C10.2 J1.6(SHIELD) R13.2
NetD3_1: D3.1(D1A) J1.2(D-)
NetD3_2: D3.2(D2A) J1.3(D+)

Not connected (* = marked no-connect by the designer): U1 K8(PMIC_VBUSOTG) K9(OTG_VBUS)

### Layout directives
differential pair: USB1_D_N, USB1_D_P, USB2_D_N, USB2_D_P

### Notes on the sheet
- MICRO USB B STYLE CONNECTOR
- - THIS CIRCUIT PROVIDES LOCAL INPUT IMPEDANCE AND EMC SUPPORT
  - A USB POWER CONNECTION IMPROVES THE CHANCE THAT A SUPPLY WILL BE +5V
  - RELATIVELY HIGH ESR RESEVOIR CAPACITORS REDUCE SUPPLY CABLE RINGING
  - ESR OF FERRITE BEAD ALSO CONTRIBUTES TO REDUCED SUPPLY CABLE RINGING
  - POWER THE BOARD FROM THE USB CONNECTOR OR FROM BREAKOUT PINS
  - IF POWERING FROM BREAKOUT PINS AND USING USB, REMOVE THE FERRITE BEAD
  - THE CAPACITANCE ON THE USB POWER MIGHT NOT FULLY MEET THE USB
  SPECIFICATION, AND ALTHOUGH IT WILL WORK IN MOST CASES, THE LARGER
  CAPACITORS COULD BE REMOVED AS NEEDED TO EXPERIMENTALLY REFINE
  AN APPLICATION SPECIFIC DESIGN CONFIGURATION
- TITLE:
- DRAWING:
- MODIFIED:
- REVISION:
- SHEET
- OF
- ALLIED COMPONENT WORKS
- CAD FILE:
- (in symbol OSD32MP157C, part M) USB

### Library data of the parts
C5-C7 C10 = CERCAP: Tolerance: 10%; Voltage: 25V; Value: 0.22uF
C8 C9 = POLCAP: Tolerance: 20%; Voltage: 10V; Value: 10uF
D3 = ECMF02-2AMX6: USB Filter And ESD Protection; PartNumber: ECMF02-2AMX6
J1 = USB_MICRO_B: USB Micro B Connetor; PartNumber: UJ2-MIBH2-4-SMT
L1 = BEAD: Impedence: 300; CurrentRating: 0.8A; PartNumber: MPZ1608S102ATA00; Size: 0603
R13 = RESISTOR: Tolerance: 5%; Power: 0.1W; Voltage: 50V; Value: 12K
U1 = OSD32MP157C: as U1 on sheet OSD19001_CORE; PartNumber: OSD32MP157C-512M-BAA; ComponentLink1Description: TBD; ComponentLink1URL: http://TBD

## Nets that join several sheets
+3.3V: OSD19001_CORE (5 pins), OSD19001_BREAKOUTS (13 pins)
+VBAT: OSD19001_CORE (U1.K3), OSD19001_BREAKOUTS (PC16.1)
+VBST: OSD19001_CORE (U1.J8 U1.J9), OSD19001_BREAKOUTS (PC18.1)
+VIN: OSD19001_CORE (11 pins), OSD19001_BREAKOUTS (PA01.1 PB01.1), OSD19001_USB (5 pins)
+VLDO2: OSD19001_CORE (U1.G4), OSD19001_BREAKOUTS (PC15.1)
+VSW: OSD19001_CORE (U1.G9 U1.G10), OSD19001_BREAKOUTS (PC17.1)
GND: OSD19001_CORE (79 pins), OSD19001_BREAKOUTS (8 pins), OSD19001_USB (11 pins)
~{PONKEY}: OSD19001_CORE (U1.D3), OSD19001_BREAKOUTS (PC14.1)
~{RESET}: OSD19001_CORE (R7.1 R8.2 TP1.10 U1.M3), OSD19001_BREAKOUTS (PD02.1)
USB1_D_N: OSD19001_BREAKOUTS (PB30.1), OSD19001_USB (U1.K18)
USB1_D_P: OSD19001_BREAKOUTS (PB29.1), OSD19001_USB (U1.K17)